# Altium schematic sheet CC2530节点底板.SchDoc
size 431 x 203 mm
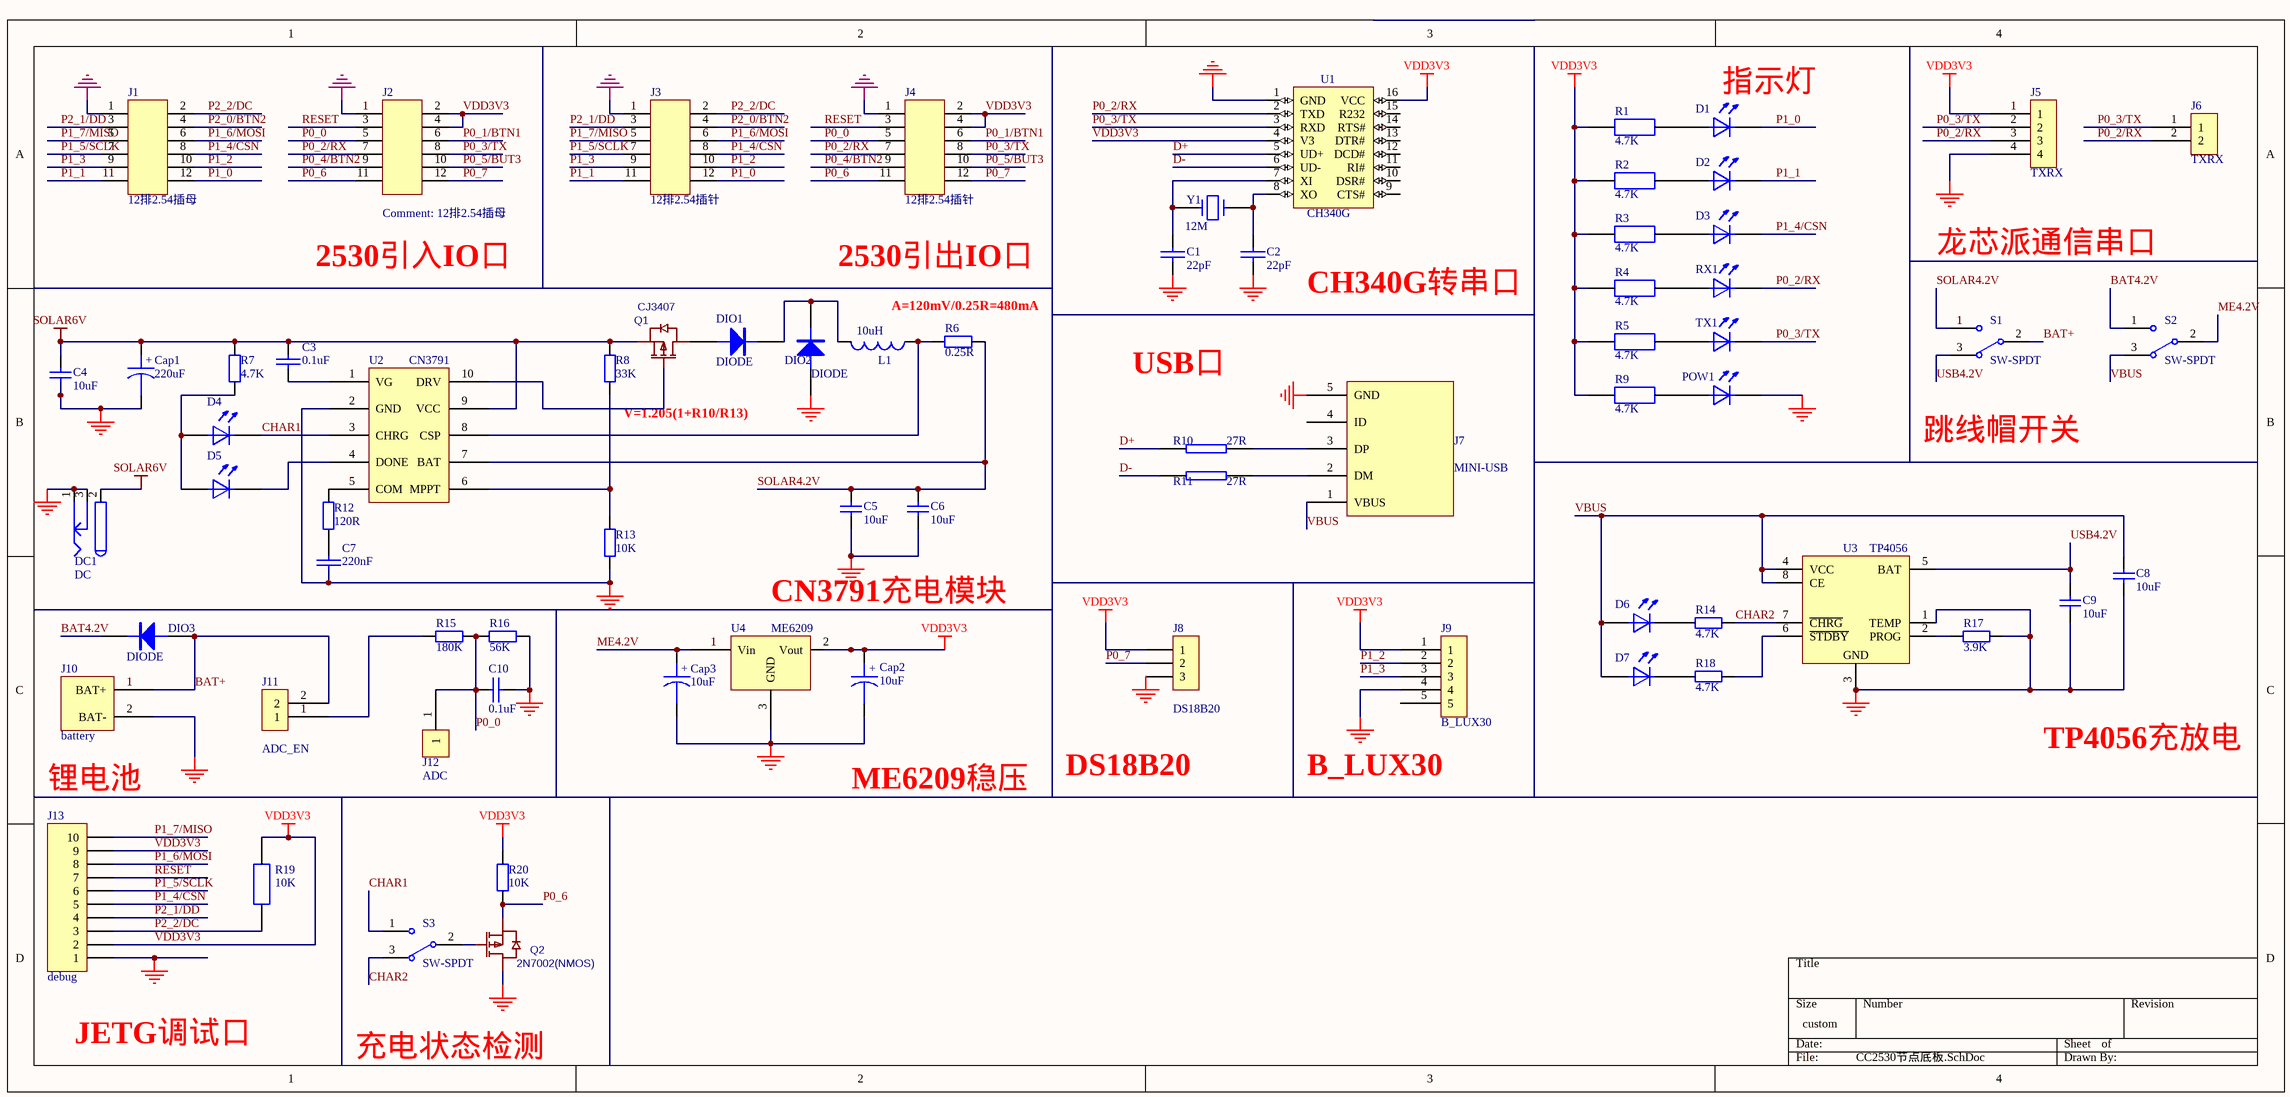
[diagram p0: CC2530节点底板.SchDoc]

## Parts
C1  22pF  [C 0603_L]
C2  22pF  [C 0603_L]
C3  0.1uF  [C 0603_L]
C4  10uF  [C 0805_L]
C5  10uF  [C 0805_L]
C6  10uF  [C 0805_L]
C7  220nF  [C 0603_L]
C8  10uF  [C 0805_L]
C9  10uF  [C 0805_L]
C10  0.1uF  [C 0603_L]
Cap1  220uF  [CM E(8*10.2)]
Cap2  10uF  [CM C(5*5.4)]
Cap3  10uF  [CM C(5*5.4)]
D1  (no value)  [LED 0805W]
D2  (no value)  [LED 0805W]
D3  (no value)  [LED 0805W]
D4  (no value)  [LED 0805R]
D5  (no value)  [LED 0805G]
D6  (no value)  [LED 0805R]
D7  (no value)  [LED 0805G]
DC1  DC  [DC-005]
DIO1  DIODE  [SOD-323]
DIO2  DIODE  [SOD-323]
DIO3  DIODE  [SOD-323]
J1  12排2.54插母  [HDR2.54-M-LS-2x6P]
J2  12排2.54插母  [HDR2.54-M-LS-2x6P]
J3  12排2.54插针  [HDR2.54-LI-2x6P]
J4  12排2.54插针  [HDR2.54-LI-2x6P]
J5  TXRX  [HDR2.54-M-LI-4P]
J6  TXRX  [HDR2.54-LI-2P]
J7  MINI-USB  [USB-MINI-A]
J8  (no value)  [HDR2.54-M-LI-3P]
J9  B_LUX30  [HDR2.0-M-LI-5P]
J10  battery  [单节贴片锂电池座]
J11  ADC_EN  [HDR2.54-LI-2P]
J12  ADC  [HDR2.54-LI-1P]
J13  debug  [DC-2.54-L-Z-10P]
L1  10uH  [NR5020]
POW1  (no value)  [LED 0805R]
Q1  CJ3407  [SOT-23]
Q2  2N7002(NMOS)  [SOT-23]
R1  4.7K  [R 0603-HP_L]
R2  4.7K  [R 0603-HP_L]
R3  4.7K  [R 0603-HP_L]
R4  4.7K  [R 0603-HP_L]
R5  4.7K  [R 0603-HP_L]
R6  0.25R  [R 0805-HP_L]
R7  4.7K  [R 0603-HP_L]
R8  value 33K  [R 0603-HP_L]  (hidden comment: 75K)
R9  4.7K  [R 0603-HP_L]
R10  27R  [R 0603-HP_L]
R11  27R  [R 0603-HP_L]
R12  120R  [R 0603-HP_L]
R13  10K  [R 0603-HP_L]
R14  value 4.7K  [R 0603-HP_L]  (hidden comment: 1K)
R15  value 180K  [R 0603-HP_L]  (hidden comment: 168K)
R16  56K  [R 0603-HP_L]
R17  3.9K  [R 0603-HP_L]
R18  value 4.7K  [R 0603-HP_L]  (hidden comment: 1K)
R19  10K  [R 0603-HP_L]
R20  value 10K  [R 0603-HP_L]  (hidden comment: 168K)
RX1  (no value)  [LED 0805R]
S1  SW-SPDT  [HDR2.54-LI-3P]
S2  SW-SPDT  [HDR2.54-LI-3P]
S3  SW-SPDT  [HDR2.54-LI-3P]
TX1  (no value)  [LED 0805R]
U1  CH340G  [SOP16]
U2  CN3791  [SSOP-10_150mil]
U3  TP4056  [SOP8]
U4  ME6209  [SOT89_M]
Y1  12M  [OSC HC-49S]

## Nets
GND: C1.2 C2.2 C4.2 C5.2 C6.2 C7.2 C8.1 C9.2 C10.1 Cap1.2 Cap2.2 Cap3.2 DC1.1 DC1.3 DIO2.1(A) J1.1 J2.1 J3.1 J4.1 J5.4 J7.5(GND) J8.3 J9.4 J10.2(BAT-) J13.1 POW1.2 Q2.2(D) R13.2 R16.1 R17.1 U1.1(GND) U2.2(GND) U3.1(TEMP) U3.3(GND) U4.3(GND)
SOLAR6V: C3.1 C4.1 Cap1.1 DC1.2 Q1.3(S) R7.1 R8.1 U2.9(VCC)
VDD3V3: Cap2.1 J2.2 J2.4 J4.2 J4.4 J5.1 J8.1 J9.1 J13.2 J13.9 R1.1 R2.1 R3.1 R4.1 R5.1 R9.1 R19.2 R20.1 U1.4(V3) U1.16(VCC) U4.2(Vout)
BAT4.2V: DIO3.2(K) S2.1
BAT+: DIO3.1(A) J10.1(BAT+) J11.2 S1.2
CHAR1: D4.2 S3.1 U2.3(CHRG)
CHAR2: R14.1 S3.3 U3.7(~{CHRG})
D+: R10.1 U1.5(UD+)
D-: R11.1 U1.6(UD-)
ME4.2V: Cap3.1 S2.2 U4.1(Vin)
P0_0: C10.2 J2.5 J4.5 J12.1 R15.1 R16.2
P0_1/BTN1: J2.6 J4.6
P0_2/RX: J2.7 J4.7 J5.3 J6.2 RX1.2 U1.2(TXD)
P0_3/TX: J2.8 J4.8 J5.2 J6.1 TX1.2 U1.3(RXD)
P0_4/BTN2: J2.9 J4.9
P0_5/BUT3: J2.10 J4.10
P0_6: J2.11 J4.11 Q2.3(S) R20.2
P0_7: J2.12 J4.12 J8.2
P1_0: D1.2 J1.12 J3.12
P1_1: D2.2 J1.11 J3.11
P1_2: J1.10 J3.10 J9.2
P1_3: J1.9 J3.9 J9.3
P1_4/CSN: D3.2 J1.8 J3.8 J13.5
P1_5/SCLK: J1.7 J3.7 J13.6
P1_6/MOSI: J1.6 J3.6 J13.8
P1_7/MISO: J1.5 J3.5 J13.10
P2_0/BTN2: J1.4 J3.4
P2_1/DD: J1.3 J3.3 J13.4
P2_2/DC: J1.2 J3.2 J13.3 R19.1
RESET: J2.3 J4.3 J13.7
SOLAR4.2V: C5.1 C6.1 R6.1 S1.1 U2.7(BAT)
USB4.2V: C9.1 S1.3 U3.5(BAT)
VBUS: C8.2 D6.1 D7.1 J7.1(VBUS) S2.3 U3.4(VCC) U3.8(CE)
NetC1_1: C1.1 U1.7(XI) Y1.1
NetC2_1: C2.1 U1.8(XO) Y1.2
NetC3_2: C3.2 U2.1(VG)
NetC7_1: C7.1 R12.2
NetD1_1: D1.1 R1.2
NetD2_1: D2.1 R2.2
NetD3_1: D3.1 R3.2
NetD4_1: D4.1 D5.1 R7.2
NetD5_2: D5.2 U2.4(DONE)
NetD6_2: D6.2 R14.2
NetD7_2: D7.2 R18.2
NetDIO1_1: DIO1.1(A) Q1.2(D)
NetDIO1_2: DIO1.2(K) DIO2.2(K) L1.1
NetJ7_2: J7.2(DM) R11.2
NetJ7_3: J7.3(DP) R10.2
NetJ11_1: J11.1 R15.2
NetL1_2: L1.2 R6.2 U2.8(CSP)
NetPOW1_1: POW1.1 R9.2
NetQ1_1: Q1.1(G) U2.10(DRV)
NetQ2_1: Q2.1(G) S3.2
NetR4_2: R4.2 RX1.1
NetR5_2: R5.2 TX1.1
NetR8_2: R8.2 R13.1 U2.6(MPPT)
NetR12_1: R12.1 U2.5(COM)
NetR17_2: R17.2 U3.2(PROG)
NetR18_1: R18.1 U3.6(~{STDBY})

Not connected (* = marked no-connect by the designer): J7 4(ID); J9 5; U1 9(CTS#) 10(DSR#) 11(RI#) 12(DCD#) 13(DTR#) 14(RTS#) 15(R232)

## Notes on the sheet
- (near D1) 指示灯
- 2530引入IO口
- 2530引出IO口
- A=120mV/0.25R=480mA
- CH340G转串口
- 龙芯派通信串口
- USB口
- (near R8) V=1.205(1+R10/R13)
- 跳线帽开关
- CN3791充电模块
- (near J8) DS18B20
- DS18B20
- (near J9) B_LUX30
- TP4056充放电
- 锂电池
- ME6209稳压
- JETG调试口
- 充电状态检测
- (in symbol CAPACITOR POL) +

## Library data of the parts
C1-C3 C7 C10 = CAP: Capacitor
C4-C6 C8 C9 = Cap: 无极性电容; Published: 8-Jun-2000; LatestRevisionDate: 17-Jul-2002; LatestRevisionNote: Re-released for DXP Platform.; PackageReference: RAD-0.3; Publisher: Altium Limited; Value: 10uF
Cap1-Cap3 = CAPACITOR POL: Capacitor
D1-D7 POW1 RX1 TX1 = LED
DC1 = PWR2.5: Low Voltage Power Supply Connector; Published: *; DatasheetDocument: *; Publisher: *; ComponentLink1Description: *; ComponentLink1URL: *
DIO1-DIO3 = DIODE: 1N5817
J1 J2 = CON12: pin to pad: 1>11 2>12 3>9 4>10 5>7 6>8 7>5 8>6 9>3 10>4 11>1 12>2
J3 J4 = CON12: pin to pad: 1>12 2>11 3>10 4>9 5>8 6>7 7>6 8>5 9>4 10>3 11>2 12>1
J5-J7 J10-J12 U2 = Component_1
J8 = CON3: Connector; pin to pad: 1>3 3>1
J9 = Component_1: pin to pad: 2>3 3>5 4>7 5>9
J13 = CON10: Connector
L1 = L: NR5020
Q1 = AOD413A: pin to pad: 2>3 3>2; BOM_Manufacturer: AOS; Contributor: LCSC; SMT Type: Extend; BOM_Supplier: LCSC; BOM_Manufacturer Part: AOD413A; BOM_Supplier Part: C115837; BOM_LCSC Assembly: Yes; spicePre: Q; spiceSymbolName: AOD413A
Q2 = AOD413A: 2N7002; BOM_Manufacturer: AOS; Contributor: LCSC; SMT Type: Extend; BOM_Supplier: LCSC; BOM_Manufacturer Part: AOD413A; BOM_Supplier Part: C115837; BOM_LCSC Assembly: Yes; spicePre: Q; spiceSymbolName: AOD413A
R1-R5 R9 R19 = R
R6-R8 R12-R18 R20 = Res1: 贴片电阻; Published: 8-Jun-2000; LatestRevisionDate: 17-Jul-2002; LatestRevisionNote: Re-released for DXP Platform.; PackageReference: AXIAL-0.4; Publisher: Altium Limited
  R6: Value: 0.25R
  R7: Value: 4.7K
  R12: Value: 120R
  R13: Value: 10K
  R16: Value: 56K
  R17: Value: 3.9K
R10 R11 = RES2
S1-S3 = SW-SPDT: 开关; pin to pad: 1>3 3>1; Published: 24-Mar-1999; LatestRevisionDate: 17-Dec-2003; LatestRevisionNote: Schematic revised, PCB Footprint replaced.; DatasheetDocument: 05-Dec-2000; PackageReference: TL36WW15050; Publisher: Altium Limited; ComponentLink1Description: Manufacturer Link; ComponentLink1URL: http://www.apem.com
U1 = CH340G: CH340
U3 = TP4056: 锂电池充电管理
U4 = Component_1: pin to pad: 1>2 2>3 3>1
Y1 = CRYSTAL: 32K